# Altium project BLUETOOTHDONGLE.PrjPcb
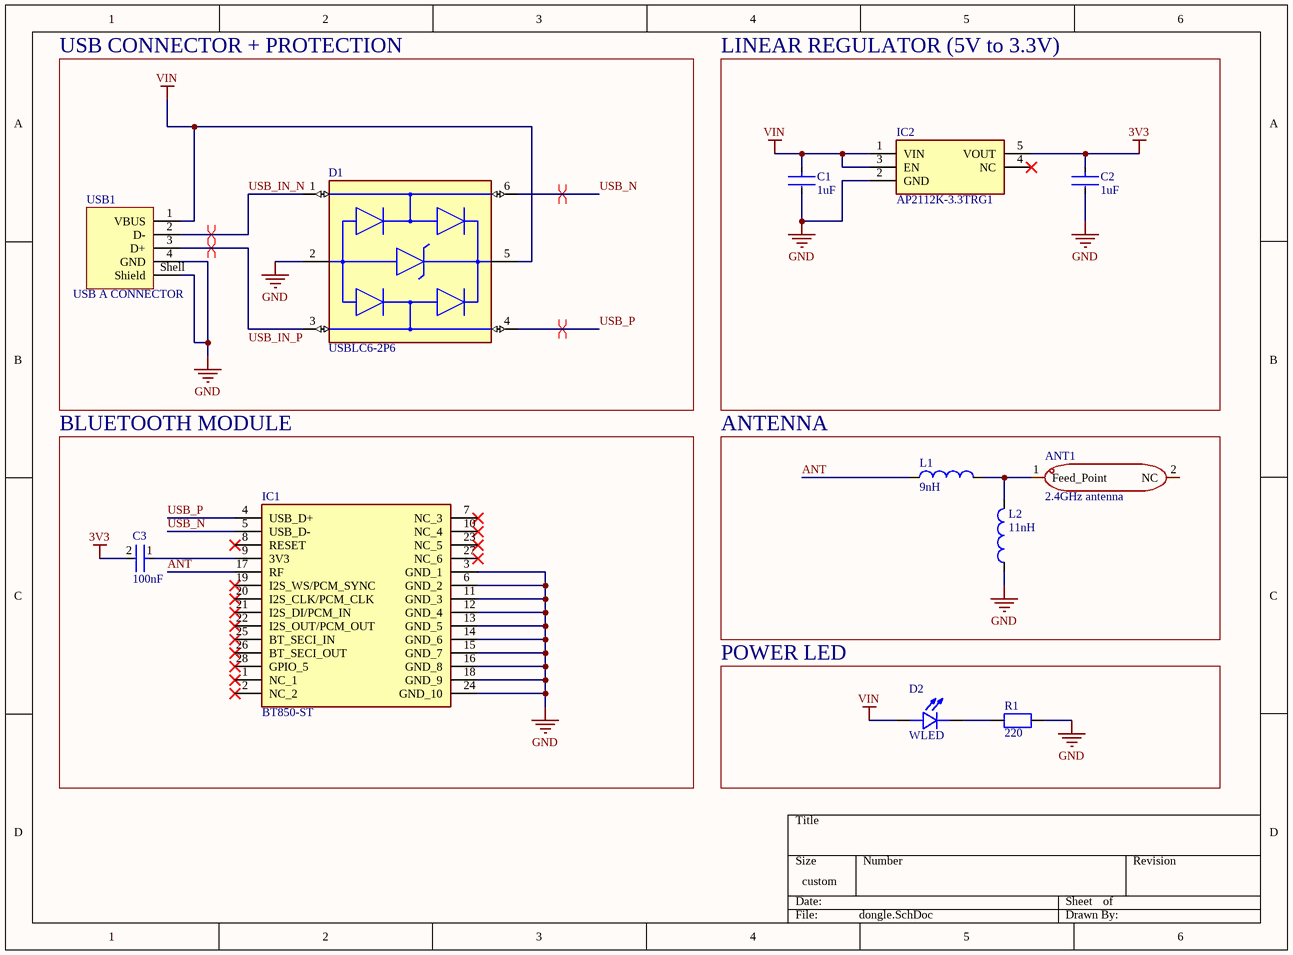
[diagram p0:  dongle.SchDoc]
1 sheet, 12 parts. Net scope: global (net labels, ports and power ports of the same name join across sheets).
Board files:  dongle.PcbDoc,  PCB2.PcbDoc,  PCB1.PcbDoc

## Sheet  dongle.SchDoc
size 241 x 177 mm; SheetNumber: 1; SheetTotal: 1

### Parts
ANT1  2.4GHz antenna  [2.4GHz antenna]
C1  1uF  [0402 capacitor]
C2  1uF  [0402 capacitor]
C3  100nF  [0402 capacitor]
D1  USBLC6-2P6  [FP-SOT-666-MFG]
D2  WLED  [LED_KT-0603R]
IC1  BT850-ST  [BT850-ST]
IC2  AP2112K-3.3TRG1  [SOT95P285X140-5N]
L1  9nH  [0402INDUCTOR]
L2  11nH  [0402INDUCTOR]
R1  220  [0402 resistor]
USB1  USB A CONNECTOR  [USB A CONNECTOR RECESSED]

### Blocks framed on the sheet
USB CONNECTOR + PROTECTION: D1 USB1
LINEAR REGULATOR (5V to 3.3V): C1 C2 IC2
BLUETOOTH MODULE: C3 IC1
ANTENNA: ANT1 L1 L2
POWER LED: D2 R1

### Nets
3V3: C2.1 C3.2 IC2.5(VOUT)
GND: C1.2 C2.2 D1.2(GND) IC1.3(GND_1) IC1.6(GND_2) IC1.11(GND_3) IC1.12(GND_4) IC1.13(GND_5) IC1.14(GND_6) IC1.15(GND_7) IC1.16(GND_8) IC1.18(GND_9) IC1.24(GND_10) IC2.2(GND) L2.1 R1.2 USB1.4(GND) USB1.Shell(Shield)
VIN: C1.1 D1.5(VBUS) D2.A IC2.1(VIN) IC2.3(EN) USB1.1(VBUS)
ANT: IC1.17(RF) L1.1
USB_IN_N: D1.1(I/O1) USB1.2(D-)
USB_IN_P: D1.3(I/O2) USB1.3(D+)
USB_N: D1.6(I/O1) IC1.5(USB_D-)
USB_P: D1.4(I/O2) IC1.4(USB_D+)
NetANT1_1: ANT1.1(Feed_Point) L1.2 L2.2
NetC3_1: C3.1 IC1.9(3V3)
NetD2_C: D2.C R1.1

Not connected (* = marked no-connect by the designer): ANT1 2(NC); IC1 1(NC_1)* 2(NC_2)* 7(NC_3)* 8(RESET)* 10(NC_4)* 19(I2S_WS/PCM_SYNC)* 20(I2S_CLK/PCM_CLK)* 21(I2S_DI/PCM_IN)* 22(I2S_OUT/PCM_OUT)* 23(NC_5)* 25(BT_SECI_IN)* 26(BT_SECI_OUT)* 27(NC_6)* 28(GPIO_5)*; IC2 4(NC)*

### Layout directives
differential pair: USB_IN_N, USB_IN_P, USB_N, USB_P

### Library data of the parts
C1-C3 = 0402 capacitor: 0402 smd capacitor
D1 = CMP-12225-000058-1: TVS DIODE 5.25V 17V SOT666; Min Breakdown Voltage: 6V; Power Line Protection: Yes; Element Configuration: Dual; Test Current: 1mA; Working Voltage: 5V; Number of Channels: 2; Max Reverse Leakage Current: 150nA; Direction: Unidirectional; Peak Pulse Current: 5A; Number of Elements: 1; Capacitance: 3.5pF; Max Breakdown Voltage: 6V; Height: 0.6mm; Depth: 1.3mm; Contact Plating: Tin; Reverse Breakdown Voltage: 6V; REACH SVHC: No SVHC; Operating Supply Voltage: 5V; Width: 1.3mm; Max Operating Temperature: 125°C; Reverse Standoff Voltage: 5V; ESD Protection: Yes; Package Quantity: 1; Termination: SMD/SMT; Length: 1.7mm; Leakage Current: 150nA; Number of Bidirectional Channels: 2; Case/Package: SOT-666; Min Operating Temperature: -40°C; Number of Pins: 6; Clamping Voltage: 17V; Breakdown Voltage: 6V; Lead Free: Lead Free; Radiation Hardening: No; Packaging: Tape and Reel; Mount: Surface Mount; Polarity: Unidirectional
D2 = KT-0603R: Red 0603 Light Emitting Diodes; MF: Hubei KENTO Elec; SnapEDA_Link: https://www.snapeda.com/parts/KT-0603R/Hubei+KENTO+Elec/view-part/?ref=snap; Package: Package; Value: *; MP: KT-0603R; Check_prices: https://www.snapeda.com/parts/KT-0603R/Hubei+KENTO+Elec/view-part/?ref=eda
IC2 = AP2112K-3.3TRG1: Integrated Circuit; Manufacturer_Name: Diodes Incorporated; Datasheet Link: https://www.diodes.com//assets/Datasheets/AP2112.pdf; Height: 1.4mm; Manufacturer_Part_Number: AP2112K-3.3TRG1; Mouser Part Number: 621-AP2112K-3.3TRG1; Mouser Price/Stock: https://www.mouser.co.uk/ProductDetail/Diodes-Incorporated/AP2112K-3.3TRG1?qs=x6A8l6qLYDDPYHosCdzh%2FA%3D%3D; Arrow Part Number: AP2112K-3.3TRG1; Arrow Price/Stock: https://www.arrow.com/en/products/ap2112k-3.3trg1/diodes-incorporated?utm_currency=USD&region=nac
L1 L2 = 0402 inductor
R1 = 0402 resistor
USB1 = USB A CONNECTOR RECESSED